# EAGLE design MegaPlay(Hammond1593J) (EAGLE 7.7.0)
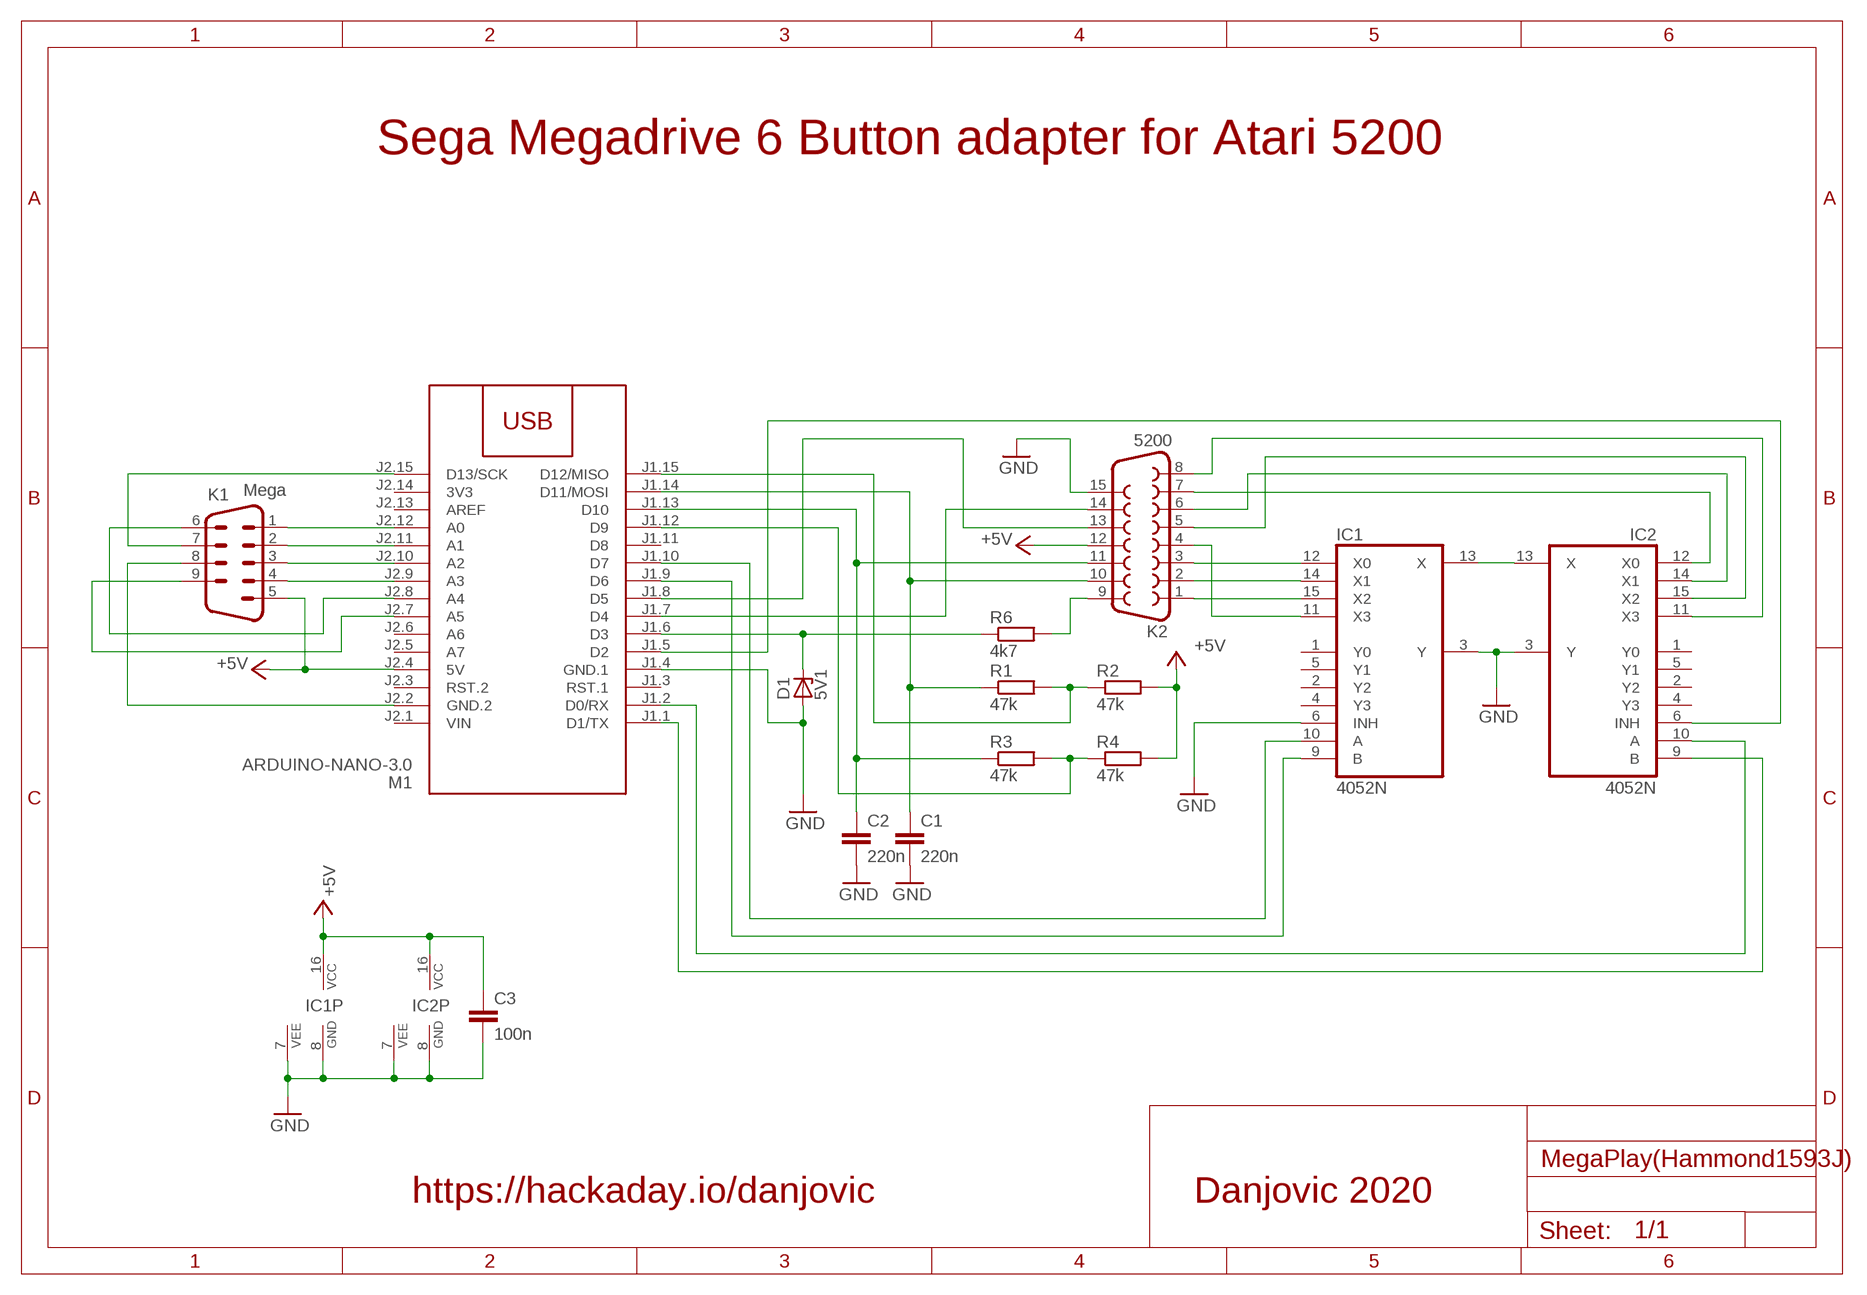
[diagram p0: schematic, sheet 1]

## Parts
C1  220n  C-EU050-025X075  [C050-025X075]
C2  220n  C-EU050-025X075  [C050-025X075]
C3  100n  C-EU050-024X044  [C050-024X044]
D1  5V1  ZENER-DIODEZD-7.5  [ZDIO-7.5]
IC1  4052N  [DIL16]
IC2  4052N  [DIL16]
K1  Mega  M09H  [M09H]
K2  5200  F15H  [F15H]
M1  ARDUINO-NANO-3.0  [ARDUINO-NANO-3.0]
R1  47k  R-EU_0204/7  [0204/7]
R2  47k  R-EU_0204/7  [0204/7]
R3  47k  R-EU_0204/7  [0204/7]
R4  47k  R-EU_0204/7  [0204/7]
R6  4k7  R-EU_0204/7  [0204/7]

## Nets
+5V: C3.1 IC1.16(VCC) IC2.16(VCC) K1.5 K2.12 M1.J2.4(5V) R2.2 R4.2
GND: C1.2 C2.2 C3.2 D1.A IC1.3(Y) IC1.6(INH) IC1.7(VEE) IC1.8(GND) IC2.3(Y) IC2.7(VEE) IC2.8(GND) K2.15 M1.J1.4(GND.1)
N$1: M1.J1.12(D9) R3.2 R4.1
N$2: IC1.15(X2) K2.1
N$3: IC1.13(X) IC2.13(X)
N$4: IC1.14(X1) K2.2
N$5: IC1.12(X0) K2.3
N$6: IC1.11(X3) K2.4
N$7: IC2.15(X2) K2.5
N$8: IC2.14(X1) K2.6
N$9: IC2.12(X0) K2.7
N$10: K1.1 M1.J2.12(A0)
N$11: C1.1 K2.10 M1.J1.14(D11/MOSI) R1.1
N$12: M1.J1.15(D12/MISO) R1.2 R2.1
N$13: IC2.11(X3) K2.8
N$14: C2.1 K2.11 M1.J1.13(D10) R3.1
N$15: K2.13 M1.J1.8(D5)
N$16: K1.2 M1.J2.11(A1)
N$17: K1.3 M1.J2.10(A2)
N$18: K1.4 M1.J2.9(A3)
N$19: K1.7 M1.J2.15(D13/SCK)
N$20: K1.6 M1.J2.8(A4)
N$21: K1.9 M1.J2.7(A5)
N$22: K1.8 M1.J2.2(GND.2)
N$23: D1.C M1.J1.6(D3) R6.1
N$24: IC2.6(INH) M1.J1.5(D2)
N$25: K2.9 R6.2
N$26: IC2.10(A) M1.J1.2(D0/RX)
N$27: IC2.9(B) M1.J1.1(D1/TX)
N$28: K2.14 M1.J1.7(D4)
N$29: IC1.10(A) M1.J1.10(D7)
N$30: IC1.9(B) M1.J1.9(D6)
Unconnected: IC1.1(Y0) IC1.2(Y2) IC1.4(Y3) IC1.5(Y1) IC2.1(Y0) IC2.2(Y2) IC2.4(Y3) IC2.5(Y1) M1.J1.3(RST.1) M1.J1.11(D8) M1.J2.3(RST.2) M1.J2.5(A7) M1.J2.6(A6) M1.J2.13(AREF)

## Notes on the sheet
- Sega Megadrive 6 Button adapter for Atari 5200
- https://hackaday.io/danjovic | Danjovic 2020

## Power pins joined to a net without a drawn wire
3V3: M1.J2.14(3V3)
VIN: M1.J2.1(VIN)

## Library data of the parts
C1-C3 = rcl:C-EU: CAPACITOR, European symbol
D1 = diode:ZENER-DIODE: Z-Diode
IC1 IC2 = 40xx:4052: Dual 4-channel ANALOG MULTIPLEXER
K1 = con-subd:M09: SUB-D; OC_FARNELL: unknown; OC_NEWARK: unknown
K2 = con-subd:F15: SUB-D; OC_FARNELL: unknown; OC_NEWARK: unknown
M1 = diy-modules:ARDUINO-NANO-3.0: Arduino Nano 3.0 and compatible devices More details available here: https://www.arduino.cc/en/Main/ArduinoBoardNano Click here to find device on ebay.com <http://www.ebay.com/sch/arduino+nano>
R1-R4 R6 = rcl:R-EU_: RESISTOR, European symbol

## Board
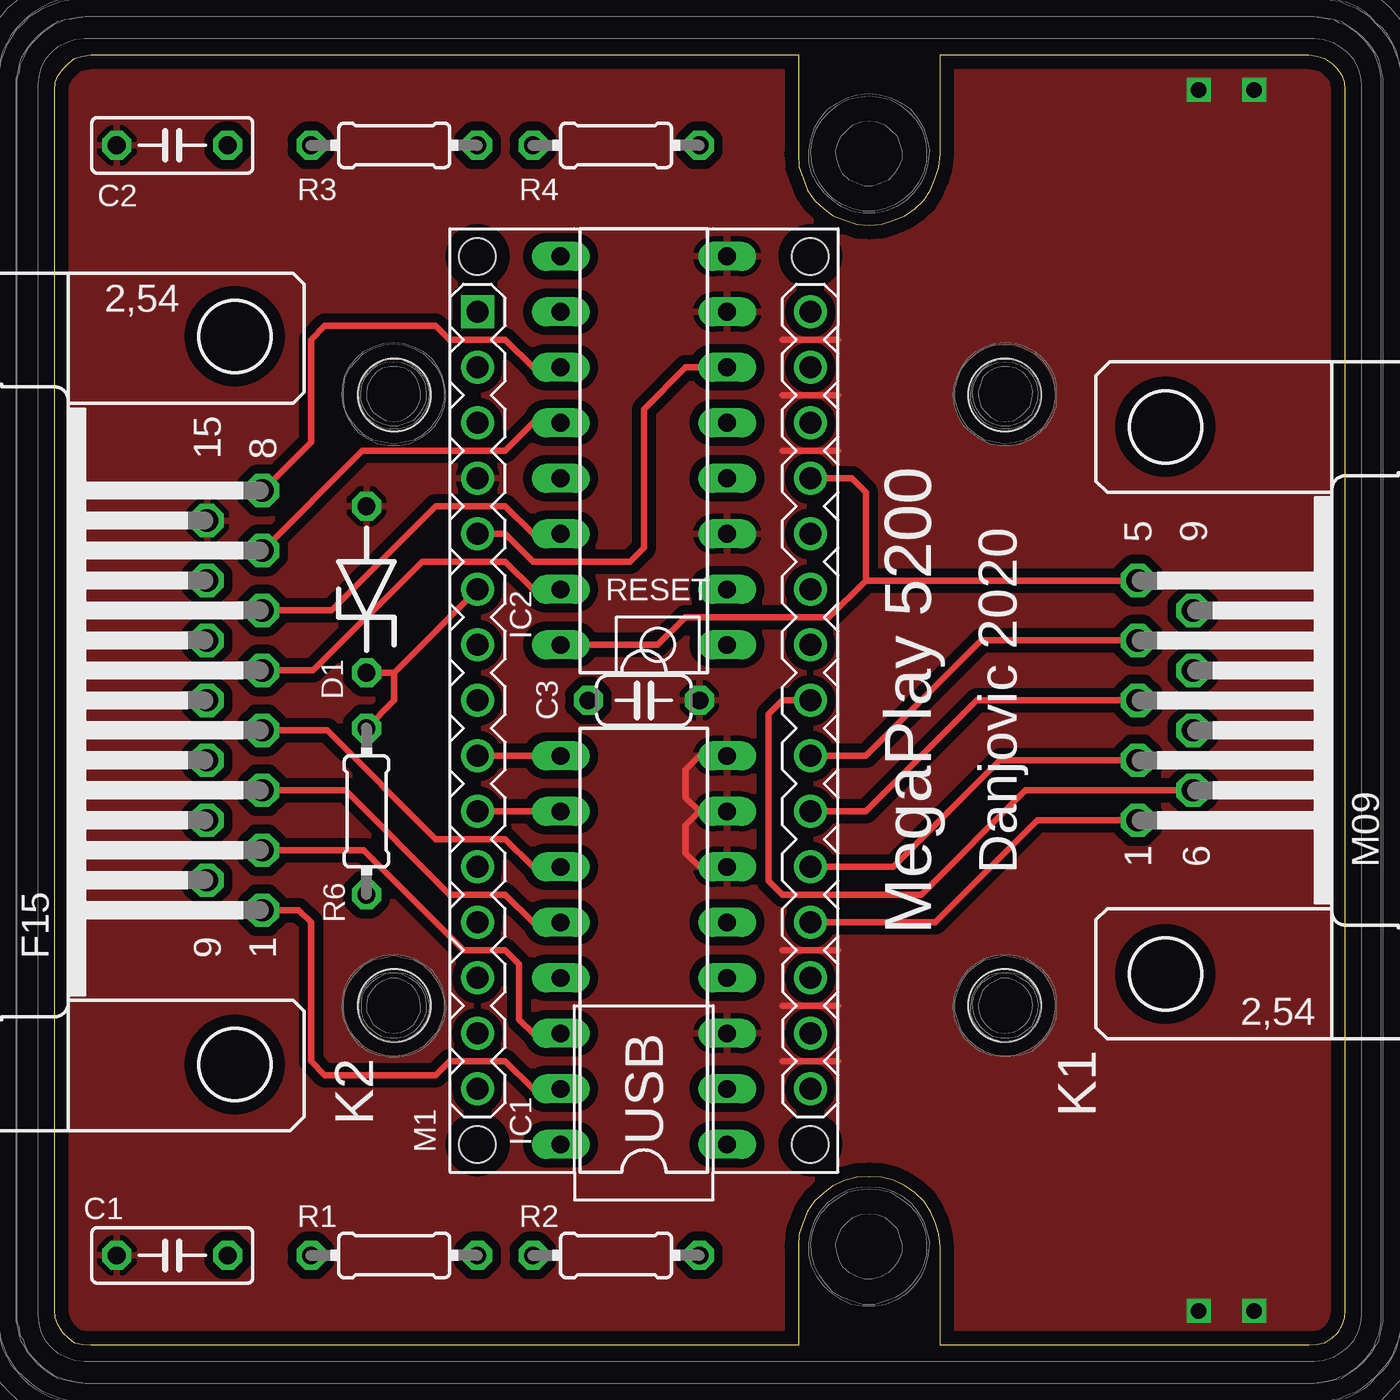
[diagram p1: board, top side]
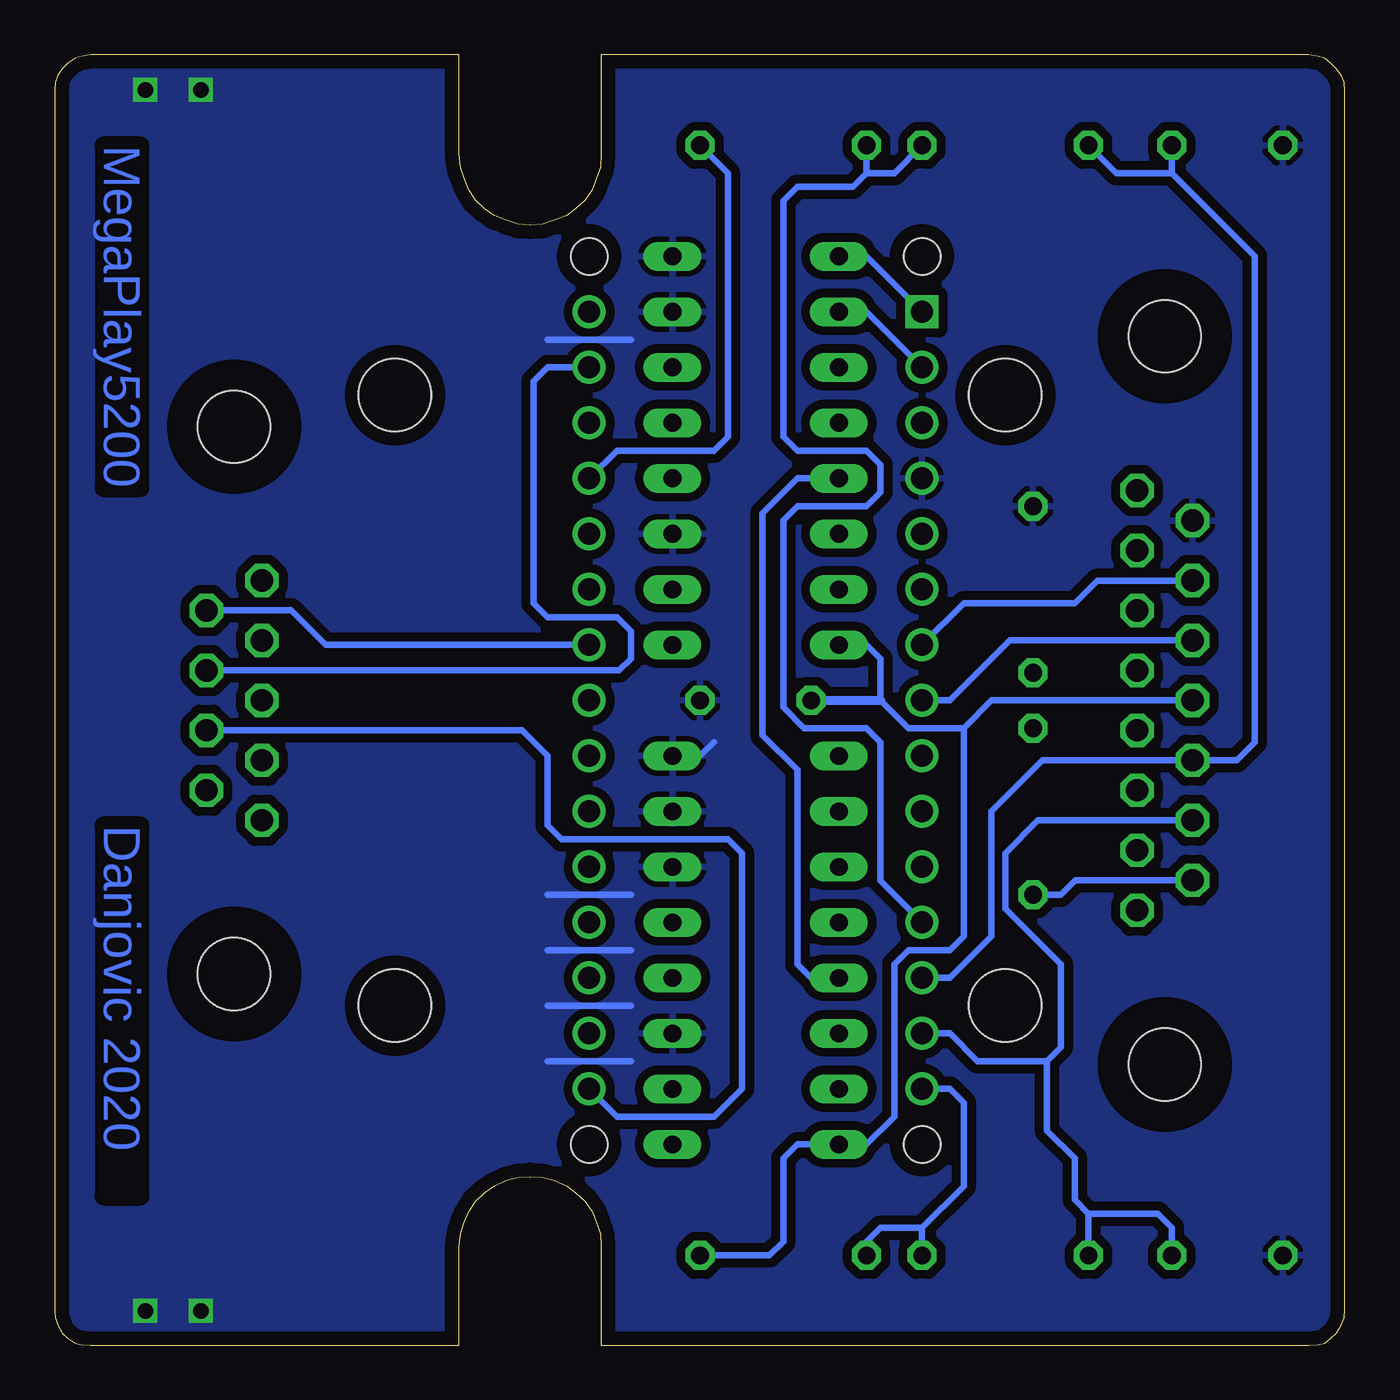
[diagram p2: board, bottom side, seen from below]

Size 59.07 x 59.07 mm. Coordinates in mm from the lower left corner, seen from the top.
Copper layers (1*16): Top 0.035mm / dielectric 1.5mm / Bottom 0.035mm
Design rules "default *": minimum track width 10mil, minimum drill 24mil, track to track 8mil, track to pad 8mil, pad to pad 8mil, via to via 8mil, smd to smd 8mil, copper to edge 25mil, drill to drill 8mil, minimum pad ring 10mil, minimum via ring 8mil, stop-mask expansion 4mil, vias tented up to drill 0mil, thermal gap 10mil

### Footprints (pad centres in the part's own frame; a part is rotated, then mirrored left to right if it is on the bottom)
C050-025X075 = drill 0.813 octagon: 1 -2.54,0; 2 2.54,0
C050-024X044 = drill 0.813 octagon: 1 -2.54,0; 2 2.54,0
ZDIO-7.5 = drill 0.813 octagon: A 3.81,0; C -3.81,0
DIL16 = drill 0.813 long: 1 -8.89,-3.81; 2 -6.35,-3.81; 3 -3.81,-3.81; 4 -1.27,-3.81; 5 1.27,-3.81; 6 3.81,-3.81; 7 6.35,-3.81; 8 8.89,-3.81; 9 8.89,3.81; 10 6.35,3.81; 11 3.81,3.81; 12 1.27,3.81; 13 -1.27,3.81; 14 -3.81,3.81; 15 -6.35,3.81; 16 -8.89,3.81
M09H = drill 1.016 octagon: 1 -5.486,1.27; 2 -2.743,1.27; 3 0,1.27; 4 2.743,1.27; 5 5.486,1.27; 6 -4.115,-1.27; 7 -1.372,-1.27; 8 1.372,-1.27; 9 4.115,-1.27 | hole 3.302: 12.522,0; -12.522,0
F15H = drill 1.016 octagon: 1 -9.601,-1.27; 2 -6.858,-1.27; 3 -4.115,-1.27; 4 -1.372,-1.27; 5 1.372,-1.27; 6 4.115,-1.27; 7 6.858,-1.27; 8 9.601,-1.27; 9 -8.23,1.27; 10 -5.486,1.27; 11 -2.743,1.27; 12 0,1.27; 13 2.743,1.27; 14 5.486,1.27; 15 8.23,1.27 | hole 3.302: -16.662,0; 16.662,0
ARDUINO-NANO-3.0 = drill 1 square: J1.1 17.78,7.62 | drill 1: J1.2 15.24,7.62; J1.3 12.7,7.62; J1.4 10.16,7.62; J1.5 7.62,7.62; J1.6 5.08,7.62; J1.7 2.54,7.62; J1.8 0,7.62; J1.9 -2.54,7.62; J1.10 -5.08,7.62; J1.11 -7.62,7.62; J1.12 -10.16,7.62; J1.13 -12.7,7.62; J1.14 -15.24,7.62; J1.15 -17.78,7.62; J2.1 17.78,-7.62; J2.2 15.24,-7.62; J2.3 12.7,-7.62; J2.4 10.16,-7.62; J2.5 7.62,-7.62; J2.6 5.08,-7.62; J2.7 2.54,-7.62; J2.8 0,-7.62; J2.9 -2.54,-7.62; J2.10 -5.08,-7.62; J2.11 -7.62,-7.62; J2.12 -10.16,-7.62; J2.13 -12.7,-7.62; J2.14 -15.24,-7.62; J2.15 -17.78,-7.62 | hole 1.651: -20.32,7.62; -20.32,-7.62; 20.32,-7.62; 20.32,7.62
0204/7 = drill 0.813 octagon: 1 -3.81,0; 2 3.81,0
1593J = hole 3.302: -13.97,-13.97; 13.97,-13.97; -13.97,13.97; 13.97,13.97

### Placement (x,y rotation side)
C1  5.39,4.12 180 top
C2  5.39,54.92 180 top
C3  26.98,29.52 0 top
D1  14.28,34.6 90 top
IC1  26.98,18.09 90 top
IC2  26.98,40.95 90 top
K1  50.85,29.52 90 top
K2  8.25,29.52 90 top
M1  26.98,29.52 90 top
R1  15.55,4.12 0 top
R2  25.71,4.12 0 top
R3  15.55,54.92 0 top
R4  25.71,54.92 0 top
R6  14.28,24.44 270 top
U$1  [1593J]  29.52,29.52 90 top

### Tracks (layer width: path | path; a pad name or v marks a point on that pad's centre or on a via)
+5V
  Top 0.305: M1.J2.4 36.5,39.68 37.14,39.04 37.14,35 | IC2.16 27.61,32.06 28.88,33.33 35.46,33.33 37.14,35 | 37.14,35 K1.5 | K1.5
  Bottom 0.305: 17.45,28.25 19.99,28.25 21.26,29.52 21.26,31.42 21.9,32.06 IC2.16 | R2.2 26.34,4.12 25.71,4.75 25.71,8.56 25.07,9.2 IC1.16 21.9,9.2 20.63,10.47 20.63,17.45 19.99,18.09 18.09,18.09 17.45,18.72 17.45,28.25 | 17.45,28.25 16.18,29.52 K2.12 | R4.2 28.25,53.65 28.25,41.58 28.88,40.95 33.33,40.95 M1.J2.4
  Bottom 0.406: C3.1 21.26,29.52
GND  (via drill 0.7)
  Top 0.305: 29.52,24.44 28.88,25.07 28.88,26.34 29.52,26.98 IC1.8 | IC1.6 29.52,21.9 28.88,22.53 28.88,23.8 29.52,24.44 | 29.52,24.44 IC1.7 | 33.33,46.03 35.87,46.03 | 33.33,43.49 35.87,43.49 | 33.33,40.95 35.87,40.95 | 33.33,18.09 35.87,18.09 | 33.33,15.55 35.87,15.55 | 33.33,13.01 35.87,13.01
  Bottom 0.305: 28.88,27.61 29.52,26.98 IC1.8 | 32.69,46.03 36.5,46.03 | 32.69,20.63 36.5,20.63 | 32.69,18.09 36.5,18.09 | 32.69,15.55 36.5,15.55 | 32.69,13.01 36.5,13.01
  other vias: 54.92,1.58 54.92,57.46 52.38,57.46 52.38,1.58
  pour Bottom (isolate 0.406): -0.33,-0.33 -0.33,60 59.36,60 59.36,-0.33
  pour Top (isolate 0.406): -0.33,-0.33 -0.33,60 60,60 60,-0.33
N$1
  Bottom 0.305: M1.J1.12 21.26,21.26 21.26,27.61 21.9,28.25 24.75,28.25 25.71,29.2 25.71,37.77 25.07,38.41 21.9,38.41 21.26,39.04 21.26,40.31 21.9,40.95 25.07,40.95 25.71,41.58 25.71,52.38 25.07,53.01 22.53,53.01 21.9,53.65 | R3.2 20.63,53.65 21.9,53.65 | R4.1 21.9,53.65
N$2
  Top 0.305: IC1.15 21.9,11.74 20.63,13.01 18.09,13.01 17.45,12.37 12.37,12.37 11.74,13.01 11.74,19.36 11.18,19.92 K2.1
N$3
  Bottom 0.305: IC2.13 25.07,39.68 26.66,38.09 26.66,27.93 25.07,26.34 25.07,17.45 24.44,16.82 IC1.13
N$4
  Top 0.305: IC1.14 21.9,14.28 21.26,14.91 21.26,17.45 20.63,18.09 18.72,18.09 14.15,22.66 K2.2
N$5
  Top 0.305: IC1.12 21.9,19.36 20.63,20.63 18.09,20.63 13.31,25.4 K2.3
N$6
  Top 0.305: IC1.11 21.9,21.9 20.63,23.17 17.45,23.17 12.47,28.15 K2.4
N$7
  Top 0.305: 11.84,30.89 16.82,35.87 20.63,35.87 21.9,34.6 IC2.15 | K2.5 11.84,30.89 | 11.84,30.89
N$8
  Top 0.305: IC2.14 21.9,37.14 20.63,38.41 17.45,38.41 12.68,33.63 K2.6
N$9
  Top 0.305: IC2.12 21.9,42.22 20.63,40.95 14.09,40.95 K2.7
N$10
  Top 0.305: M1.J2.12 40.31,19.36 44.99,24.03 K1.1
N$11
  Bottom 0.305: M1.J1.14 18.09,14.28 16.82,13.01 13.64,13.01 | C1.1 7.93,5.39 8.56,6.02 11.74,6.02 | 11.74,6.02 12.37,6.66 12.37,8.56 13.64,9.83 13.64,13.01 | K2.10 14.05,24.03 15.55,22.53 15.55,19.99 13.01,17.45 13.01,13.64 13.64,13.01 | R1.1 11.74,6.02
N$12
  Bottom 0.305: M1.J1.15 18.09,11.74 17.45,11.1 17.45,7.29 19.36,5.39 | R1.2 19.36,5.39 | R2.1 21.9,4.75 21.26,5.39 19.36,5.39
N$13
  Top 0.305: IC2.11 21.9,44.76 20.63,46.03 18.09,46.03 17.45,46.66 12.37,46.66 11.74,46.03 11.74,41.34 K2.8
N$14
  Bottom 0.305: M1.J1.13 18.09,16.82 16.18,18.72 16.18,24.44 13.85,26.77 K2.11 4.96,26.77 4.12,27.61 4.12,49.84 7.93,53.65 | C2.1 7.93,53.65 | 7.93,53.65 10.47,53.65 R3.1
N$15
  Bottom 0.305: K2.13 15.34,32.26 18.09,29.52 M1.J1.8
N$16
  Top 0.305: K1.2 43.28,26.77 38.41,21.9 M1.J2.11
N$17
  Top 0.305: K1.3 42.22,29.52 37.14,24.44 M1.J2.10
N$18
  Top 0.305: K1.4 42.42,32.26 37.14,26.98 M1.J2.9
N$19
  Bottom 0.305: K1.7 37.67,28.15 36.5,26.98 36.5,23.8 35.87,23.17 28.25,23.17 27.61,22.53 27.61,11.74 28.88,10.47 33.33,10.47 M1.J2.15
N$20
  Top 0.305: K1.6 44.45,25.4 39.68,20.63 33.33,20.63 32.69,21.26 32.69,28.88 33.33,29.52 M1.J2.8
N$21
  Bottom 0.305: M1.J2.7 46.66,32.06 48.24,33.63 K1.9
N$22
  Bottom 0.305: M1.J2.2 36.5,44.76 37.14,44.12 37.14,33.96 36.5,33.33 33.33,33.33 32.69,32.69 32.69,31.42 33.23,30.89 K1.8
N$23
  Top 0.305: R6.1 15.55,29.52 15.55,30.79 | 15.55,30.79 M1.J1.6 | D1.C 15.55,30.79
N$24
  Top 0.305: M1.J1.5 20.63,37.14 21.9,35.87 26.34,35.87 26.98,36.5 26.98,42.85 28.88,44.76 IC2.6
N$25
  Bottom 0.305: K2.9 12.35,21.29 13.01,20.63 R6.2
N$26
  Bottom 0.305: M1.J1.2 21.9,47.3 IC2.10
N$27
  Bottom 0.305: M1.J1.1 21.9,49.84 IC2.9
N$28
  Bottom 0.305: M1.J1.7 17.45,33.96 12.37,33.96 11.33,35 K2.14
N$29
  Top 0.305: M1.J1.10 IC1.10
N$30
  Top 0.305: M1.J1.9 IC1.9

### Text on the board
Bottom: MegaPlay5200 | Danjovic 2020
tPlace: MegaPlay 5200 | Danjovic 2020